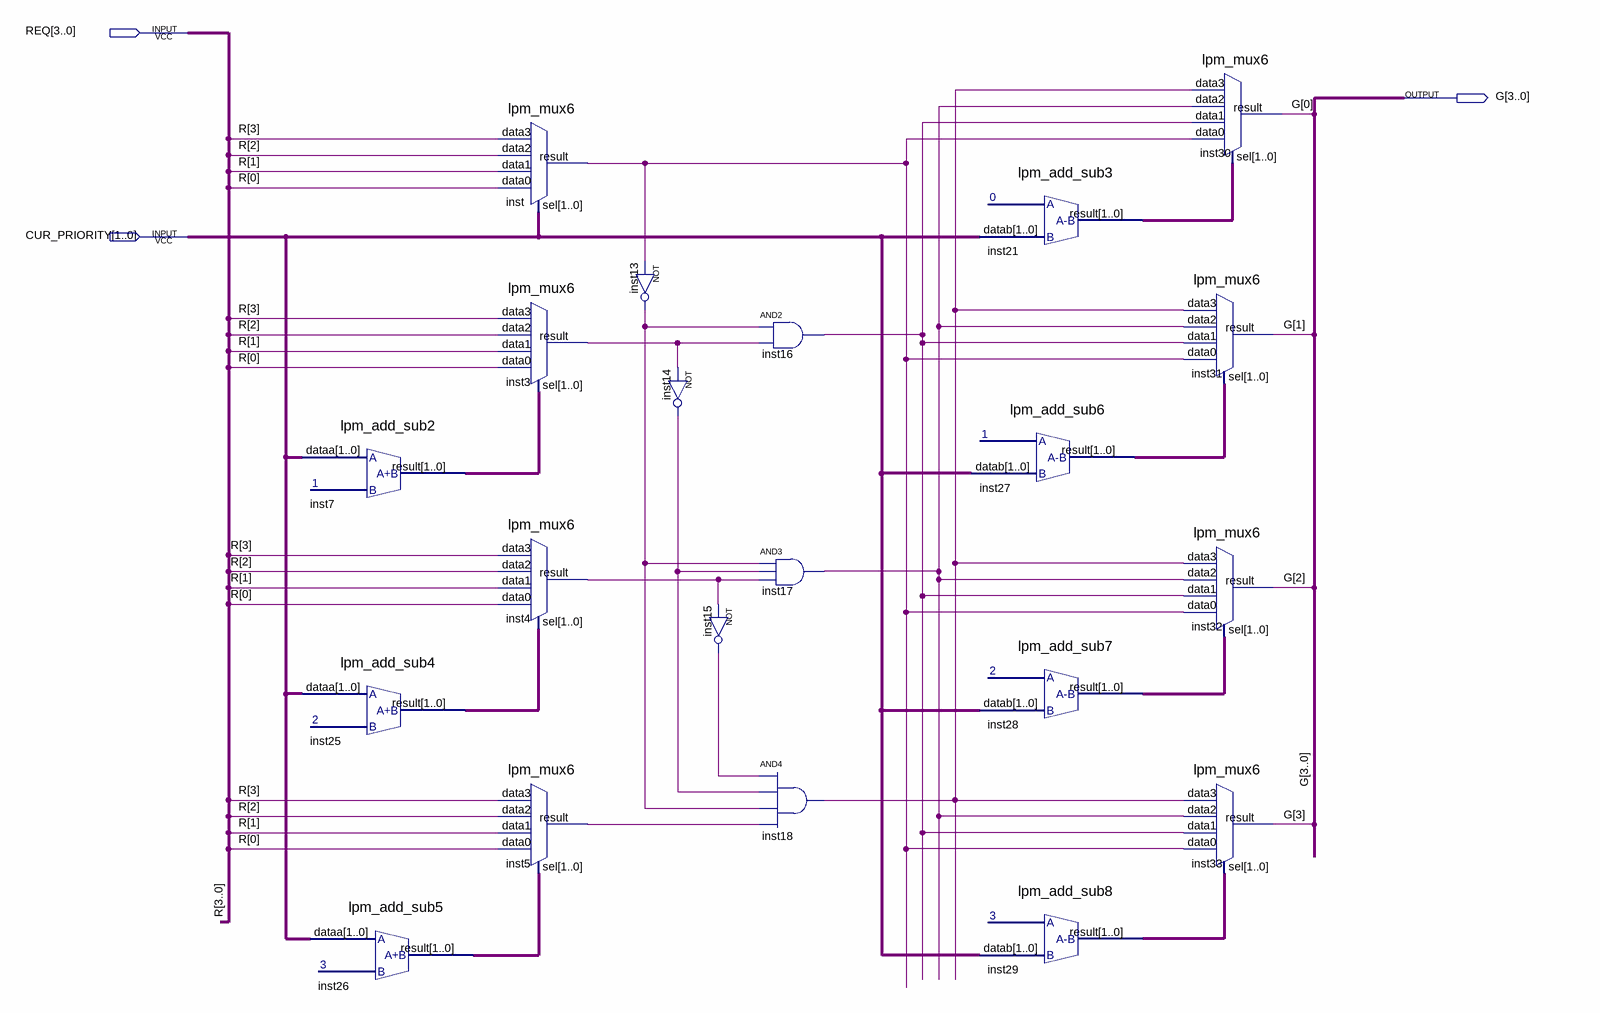
[diagram p0: schematic sheet]
// Quartus schematic ArbitrationAlgorithm.bdf as structural Verilog: 21 symbols, 3 pins
module ArbitrationAlgorithm (
  input  [3:0] REQ,
  input  [1:0] CUR_PRIORITY,
  output [3:0] G
);

  wire inst3_result, inst4_result, inst5_result, inst13_out, inst14_out, inst15_out, inst16_out, inst17_out,
       inst18_out, inst_result;
  wire [1:0] inst7_result, inst21_result, inst25_result, inst26_result, inst27_result, inst28_result,
       inst29_result;

  lpm_add_sub2 inst7 (.dataa(CUR_PRIORITY), .result(inst7_result));
  lpm_add_sub4 inst25 (.dataa(CUR_PRIORITY), .result(inst25_result));
  lpm_add_sub5 inst26 (.dataa(CUR_PRIORITY), .result(inst26_result));
  lpm_mux6 inst (
    .data3(REQ[3]), .data2(REQ[2]), .data1(REQ[1]), .data0(REQ[0]), .sel(CUR_PRIORITY), .result(inst_result));
  lpm_mux6 inst3 (
    .data3(REQ[3]), .data2(REQ[2]), .data1(REQ[1]), .data0(REQ[0]), .sel(inst7_result), .result(inst3_result));
  lpm_mux6 inst4 (
    .data3(REQ[3]), .data2(REQ[2]), .data1(REQ[1]), .data0(REQ[0]), .sel(inst25_result), .result(inst4_result));
  lpm_mux6 inst5 (
    .data3(REQ[3]), .data2(REQ[2]), .data1(REQ[1]), .data0(REQ[0]), .sel(inst26_result), .result(inst5_result));
  not inst13 (inst13_out, inst_result);
  not inst14 (inst14_out, inst3_result);
  not inst15 (inst15_out, inst4_result);
  and inst16 (inst16_out, inst13_out, inst3_result);
  and inst17 (inst17_out, inst13_out, inst14_out, inst4_result);
  and inst18 (inst18_out, inst15_out, inst14_out, inst13_out, inst5_result);
  lpm_add_sub3 inst21 (.datab(CUR_PRIORITY), .result(inst21_result));
  lpm_add_sub6 inst27 (.datab(CUR_PRIORITY), .result(inst27_result));
  lpm_add_sub7 inst28 (.datab(CUR_PRIORITY), .result(inst28_result));
  lpm_add_sub8 inst29 (.datab(CUR_PRIORITY), .result(inst29_result));
  lpm_mux6 inst30 (
    .data3(inst18_out), .data2(inst17_out), .data1(inst16_out), .data0(inst_result), .sel(inst21_result),
    .result(G[0]));
  lpm_mux6 inst31 (
    .data3(inst18_out), .data2(inst17_out), .data1(inst16_out), .data0(inst_result), .sel(inst27_result),
    .result(G[1]));
  lpm_mux6 inst32 (
    .data3(inst18_out), .data2(inst17_out), .data1(inst16_out), .data0(inst_result), .sel(inst28_result),
    .result(G[2]));
  lpm_mux6 inst33 (
    .data3(inst18_out), .data2(inst17_out), .data1(inst16_out), .data0(inst_result), .sel(inst29_result),
    .result(G[3]));

  // Other names for the same wires on the sheet: R[3:0] = REQ
endmodule
